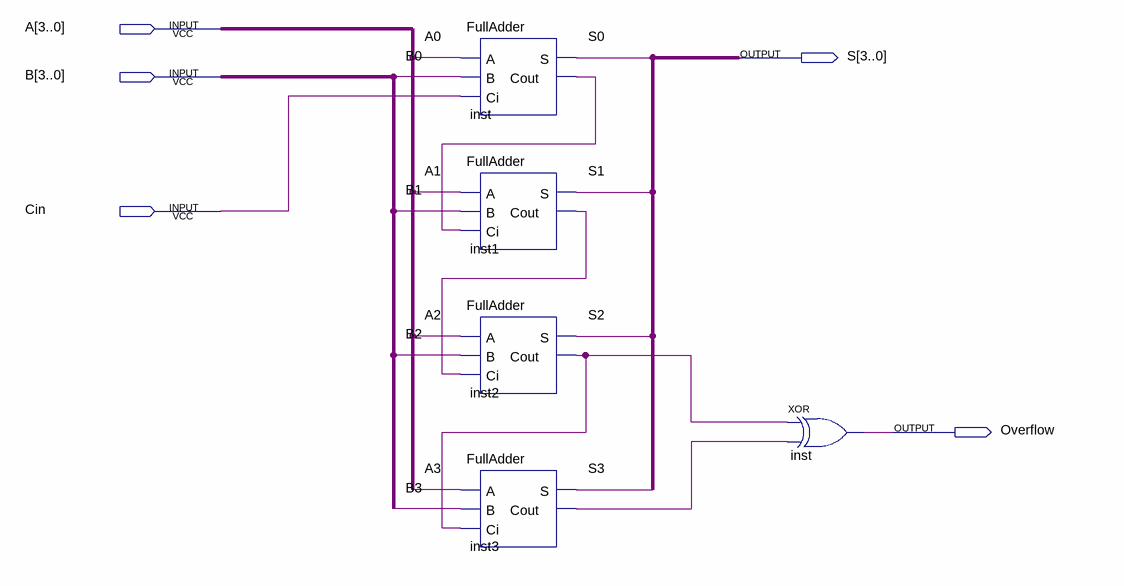
[diagram p0: schematic sheet]
// Quartus schematic Adder4.bdf as structural Verilog: 5 symbols, 5 pins
module Adder4 (
  input  [3:0] A,
  input  [3:0] B,
  input  Cin,
  output [3:0] S,
  output Overflow
);

  wire inst1_cout, inst2_cout, inst3_cout, inst_cout;

  FullAdder inst (.A(A[0]), .B(B[0]), .Ci(Cin), .S(S[0]), .Cout(inst_cout));
  FullAdder inst1 (.A(A[1]), .B(B[1]), .Ci(inst_cout), .S(S[1]), .Cout(inst1_cout));
  FullAdder inst2 (.A(A[2]), .B(B[2]), .Ci(inst1_cout), .S(S[2]), .Cout(inst2_cout));
  FullAdder inst3 (.A(A[3]), .B(B[3]), .Ci(inst2_cout), .S(S[3]), .Cout(inst3_cout));
  xor inst_dup2 (Overflow, inst2_cout, inst3_cout);
endmodule
